# EAGLE design board (EAGLE 8.2.2)

## Sheet 1 of 2
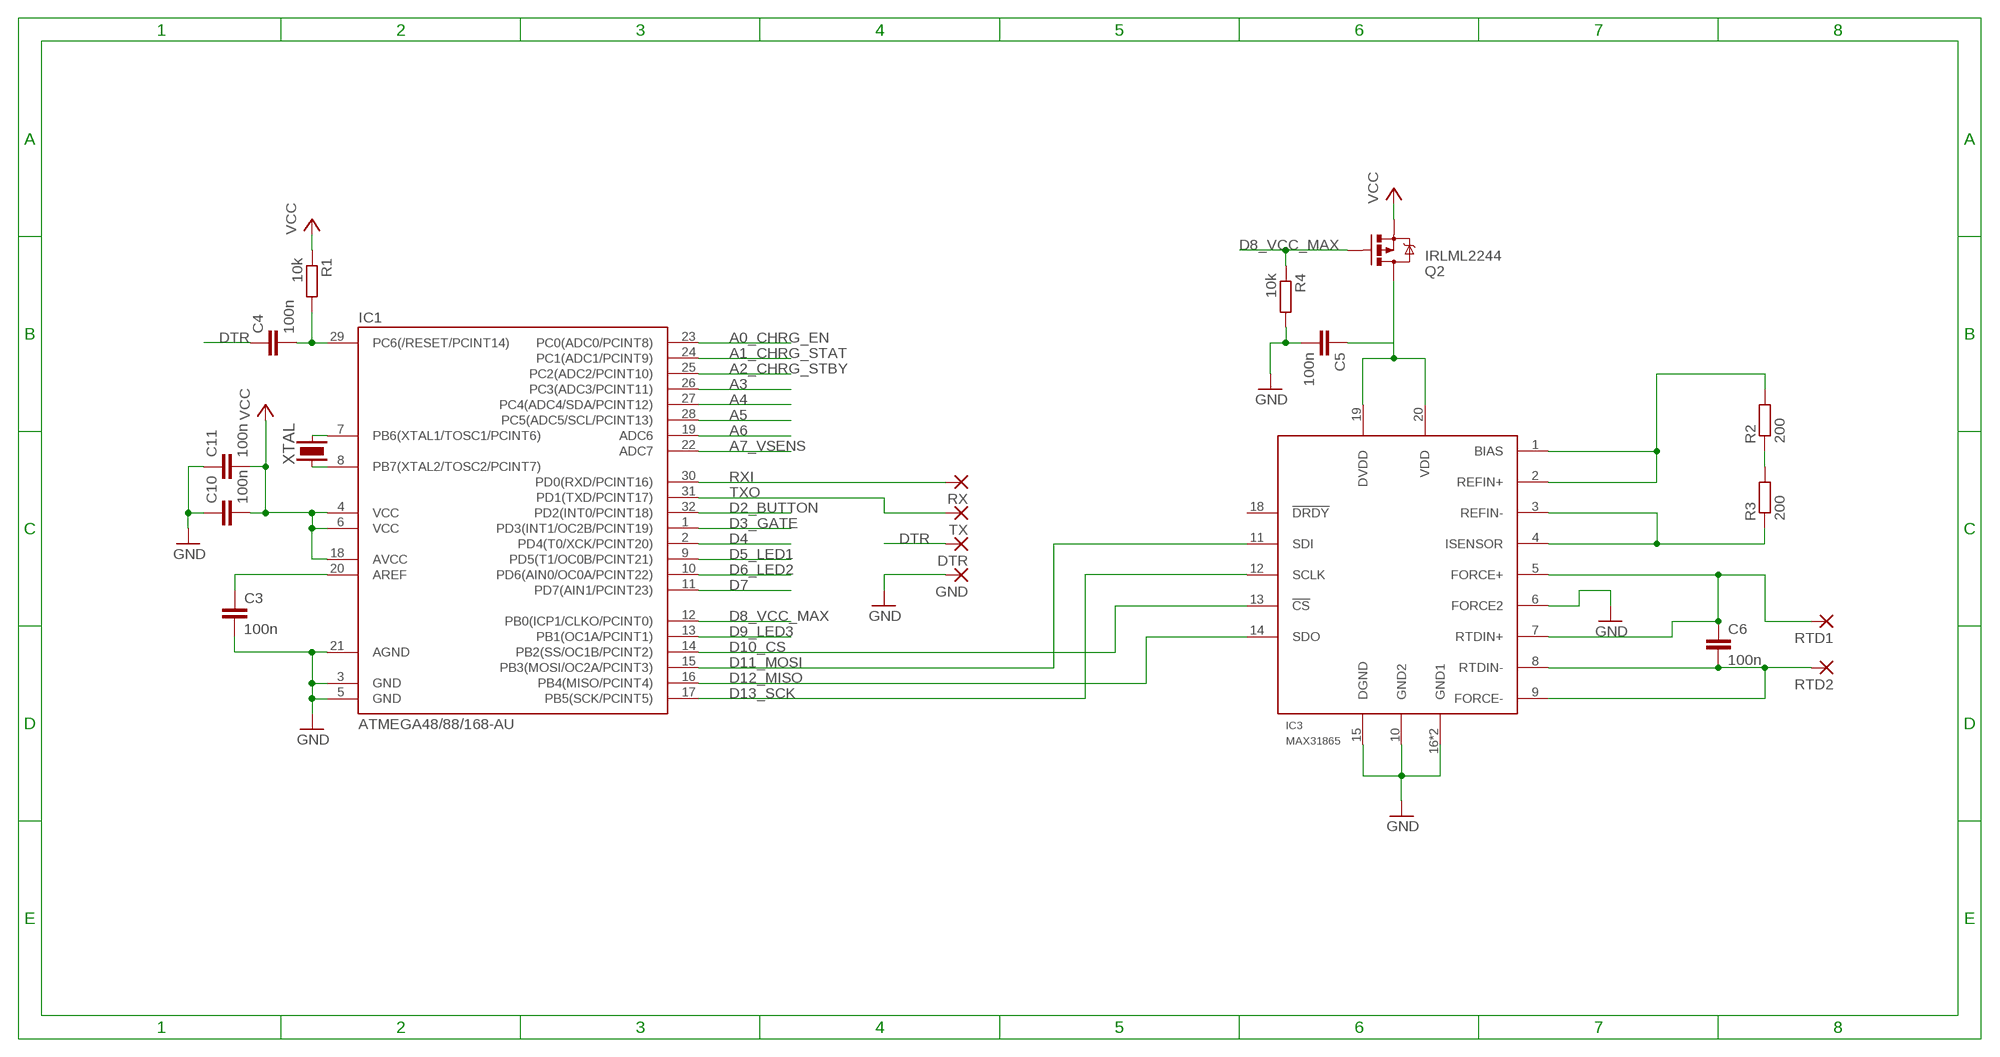
[diagram p0: schematic, sheet 1]

### Parts
C3  100n  C-EUC0603  [C0603]
C4  100n  C-EUC0603  [C0603]
C5  100n  C-EUC0603  [C0603]
C6  100n  C-EUC0603  [C0603]
C10  100n  C-EUC0603  [C0603]
C11  100n  C-EUC0603  [C0603]
DTR  SMD2  [SMD1,27-2,54]
GND  SMD2  [SMD1,27-2,54]
IC1  ATMEGA48/88/168-AU  [TQFP32-08]
IC3  MAX31865  [TQFN20-5X5]
Q2  IRLML2244  MOSFET-PCHANNELIRLML2244  [SOT23-3]
R1  10k  R-EU_R0603  [R0603]
R2  200  R-EU_R0603  [R0603]
R3  200  R-EU_R0603  [R0603]
R4  10k  R-EU_R0603  [R0603]
RTD1  SMD2  [SMD1,27-2,54]
RTD2  SMD2  [SMD1,27-2,54]
RX  SMD2  [SMD1,27-2,54]
TX  SMD2  [SMD1,27-2,54]
XTAL  XTAL-HCS10  [CS10]

### Nets
A0_CHRG_EN: IC1.23(PC0(ADC0/PCINT8)) ; also sheet 2
A1_CHRG_STAT: IC1.24(PC1(ADC1/PCINT9)) ; also sheet 2
A2_CHRG_STBY: IC1.25(PC2(ADC2/PCINT10)) ; also sheet 2
A3: IC1.26(PC3(ADC3/PCINT11))
A4: IC1.27(PC4(ADC4/SDA/PCINT12))
A5: IC1.28(PC5(ADC5/SCL/PCINT13))
A6: IC1.19(ADC6)
A7_VSENS: IC1.22(ADC7) ; also sheet 2
AREF: C3.1 IC1.20(AREF)
D2_BUTTON: IC1.32(PD2(INT0/PCINT18)) ; also sheet 2
D3_GATE: IC1.1(PD3(INT1/OC2B/PCINT19)) ; also sheet 2
D4: IC1.2(PD4(T0/XCK/PCINT20))
D5_LED1: IC1.9(PD5(T1/OC0B/PCINT21)) ; also sheet 2
D6_LED2: IC1.10(PD6(AIN0/OC0A/PCINT22)) ; also sheet 2
D7: IC1.11(PD7(AIN1/PCINT23))
D8_VCC_MAX: IC1.12(PB0(ICP1/CLKO/PCINT0)) Q2.1(G) R4.1
D9_LED3: IC1.13(PB1(OC1A/PCINT1)) ; also sheet 2
D10_CS: IC1.14(PB2(SS/OC1B/PCINT2)) IC3.13(!CS)
D11_MOSI: IC1.15(PB3(MOSI/OC2A/PCINT3)) IC3.11(SDI)
D12_MISO: IC1.16(PB4(MISO/PCINT4)) IC3.14(SDO)
D13_SCK: IC1.17(PB5(SCK/PCINT5)) IC3.12(SCLK)
DTR: C4.1 DTR.1(P)
GND: C3.2 C5.2 C10.1 C11.1 GND.1(P) IC1.3(GND) IC1.5(GND) IC1.21(AGND) IC3.6(FORCE2) IC3.10(GND2) IC3.15(DGND) IC3.16(GND1) IC3.EXP(GND1) R4.2 ; also sheet 2
N$5: R2.1 R3.2
RST: C4.2 IC1.29(PC6(/RESET/PCINT14)) R1.2
RXI: IC1.30(PD0(RXD/PCINT16)) RX.1(P)
TEMP_IN+: C6.1 IC3.5(FORCE+) IC3.7(RTDIN+) RTD1.1(P)
TEMP_IN-: C6.2 IC3.8(RTDIN-) IC3.9(FORCE-) RTD2.1(P)
TEMP_REF+: IC3.1(BIAS) IC3.2(REFIN+) R2.2
TEMP_REF-: IC3.3(REFIN-) IC3.4(ISENSOR) R3.1
TXO: IC1.31(PD1(TXD/PCINT17)) TX.1(P)
VCC: C10.2 C11.2 IC1.4(VCC) IC1.6(VCC) IC1.18(AVCC) Q2.2(S) R1.1 ; also sheet 2
VCC_MAX: C5.1 IC3.19(DVDD) IC3.20(VDD) Q2.3(D)
XTAL1: IC1.7(PB6(XTAL1/TOSC1/PCINT6)) XTAL.R(P2)
XTAL2: IC1.8(PB7(XTAL2/TOSC2/PCINT7)) XTAL.L(P1)
Unconnected: IC3.18(!DRDY)

## Sheet 2 of 2
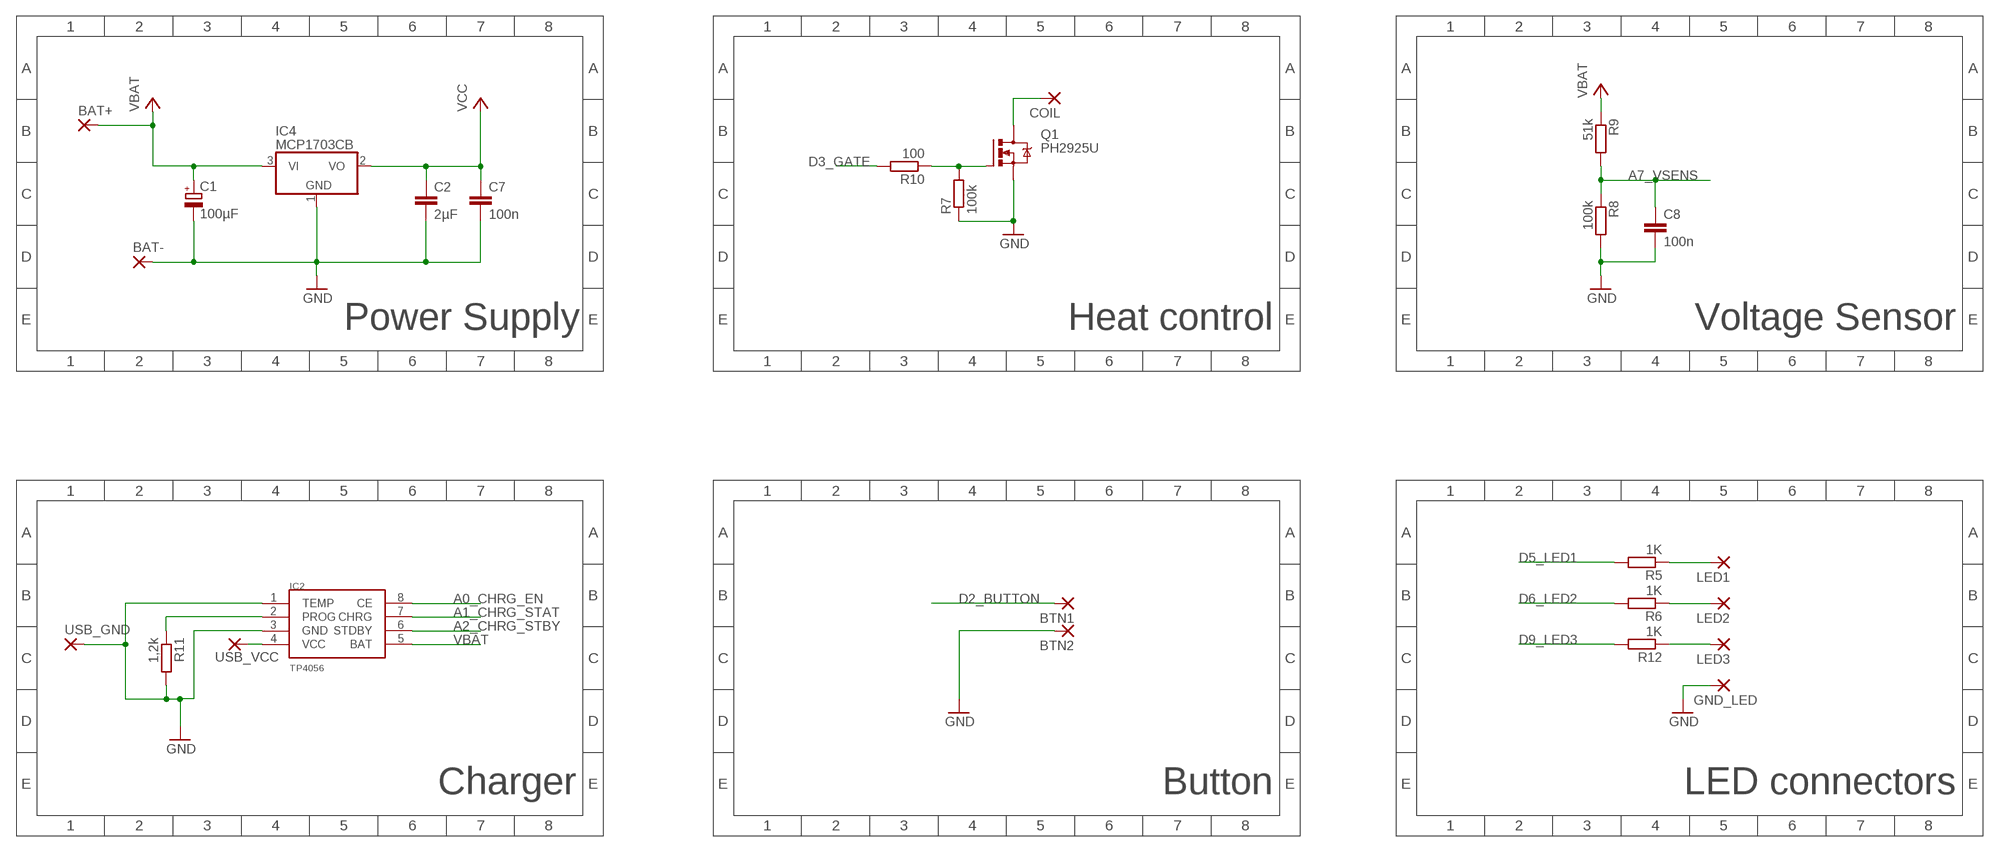
[diagram p1: schematic, sheet 2]

### Parts
BAT+  SMD2  [SMD1,27-2,54]
BAT-  WIREPAD4,16O1,6  [4,16O1,6]
BTN1  SMD2  [SMD1,27-2,54]
BTN2  SMD2  [SMD1,27-2,54]
C1  100µF  CPOL-EUCT7343  [CT7343]
C2  2µF  C-EUC1206  [C1206]
C7  100n  C-EUC0603  [C0603]
C8  100n  C-EUC0603  [C0603]
COIL  WIREPAD4,16O1,6  [4,16O1,6]
GND_LED  SMD2  [SMD1,27-2,54]
IC2  TP4056  [SOP-8]
IC4  MCP1703CB  [SOT23]
LED1  SMD2  [SMD1,27-2,54]
LED2  SMD2  [SMD1,27-2,54]
LED3  SMD2  [SMD1,27-2,54]
Q1  PH2925U  [SOT-669]
R5  1K  R-EU_R0603  [R0603]
R6  1K  R-EU_R0603  [R0603]
R7  100k  R-EU_R0603  [R0603]
R8  100k  R-EU_R0603  [R0603]
R9  51k  R-EU_R0603  [R0603]
R10  100  R-EU_R0603  [R0603]
R11  1,2k  R-EU_R0603  [R0603]
R12  1K  R-EU_R0603  [R0603]
USB_GND  SMD2  [SMD1,27-2,54]
USB_VCC  SMD2  [SMD1,27-2,54]

### Nets
A0_CHRG_EN: IC2.8(CE) ; also sheet 1
A1_CHRG_STAT: IC2.7(CHRG) ; also sheet 1
A2_CHRG_STBY: IC2.6(STDBY) ; also sheet 1
A7_VSENS: C8.1 R8.1 R9.2 ; also sheet 1
COIL: COIL.1(P) Q1.5(D)
D2_BUTTON: BTN1.1(P) ; also sheet 1
D3_GATE: R10.2 ; also sheet 1
D5_LED1: R5.2 ; also sheet 1
D6_LED2: R6.2 ; also sheet 1
D9_LED3: R12.2 ; also sheet 1
GATE: Q1.4(G) R7.2 R10.1
GND: BAT-.1(P) BTN2.1(P) C1.- C2.2 C7.2 C8.2 GND_LED.1(P) IC2.1(TEMP) IC2.3(GND) IC4.1(GND) Q1.1(S) Q1.2(S) Q1.3(S) R7.1 R8.2 R11.2 USB_GND.1(P) ; also sheet 1
LED1: LED1.1(P) R5.1
LED2: LED2.1(P) R6.1
LED3: LED3.1(P) R12.1
PROG: IC2.2(PROG) R11.1
VBAT: BAT+.1(P) C1.+ IC2.5(BAT) IC4.3(VI) R9.1
VCC: C2.1 C7.1 IC4.2(VO) ; also sheet 1
VUSB: IC2.4(VCC) USB_VCC.1(P)

### Notes on the sheet
- Heat control | Voltage Sensor
- Power Supply
- Charger | Button | LED connectors

## Library data of the parts
BAT+ BTN1 BTN2 DTR GND GND_LED LED1-LED3 RTD1 RTD2 RX TX USB_GND USB_VCC = wirepad:SMD2: SMD PAD
BAT- COIL = wirepad:WIREPAD: Wire PAD connect wire on PCB
C1 = resistor:CPOL-EU: POLARIZED CAPACITOR, European symbol
C2-C8 C10 C11 = rcl:C-EU: CAPACITOR, European symbol
IC1 = atmega8:ATMEGA48/88/168
IC2 = TP4056:TP4056
IC3 = Oles komponentbibliotek:MAX31865: RTD to Digital Converter The MAX31865 is a resistance-to-digital converter optimized for platinum resistance temperature detectors (RTDs). An external resistor sets the sensitivity for the RTD being used and a delta-sigma ADC converts the ratio of the RTD resistance to the reference resistance into digital form. The MAX31865’s inputs are protected against overvoltage faults up to +/-50V. Programmable detection of RTD and cable open and short conditions is included.
IC4 = linear:MCP1703: 250 mA, 16V, Low Quiescent Current LDO Regulator Source: http://ww1.microchip.com/downloads/en/DeviceDoc/22049b.pdf
Q1 = selfmade:PH2925U
Q2 = SparkFun-DiscreteSemi:MOSFET-PCHANNEL: Generic PMOSFET IRLML2244 - TRANS-11153 (SOT-23 -20V -4.3A) (1.Gate 2.Source 3.Drain) FQP27P06 - COM-10349 <http://www.sparkfun.com/products/10349> (TO-220 -60V -27A) (1.Gate 2.Source 3.Drain); PROD_ID: TRANS-11153
R1-R12 = rcl:R-EU_: RESISTOR, European symbol
XTAL = xtal:XTAL-H: Quartz crystal

## Board
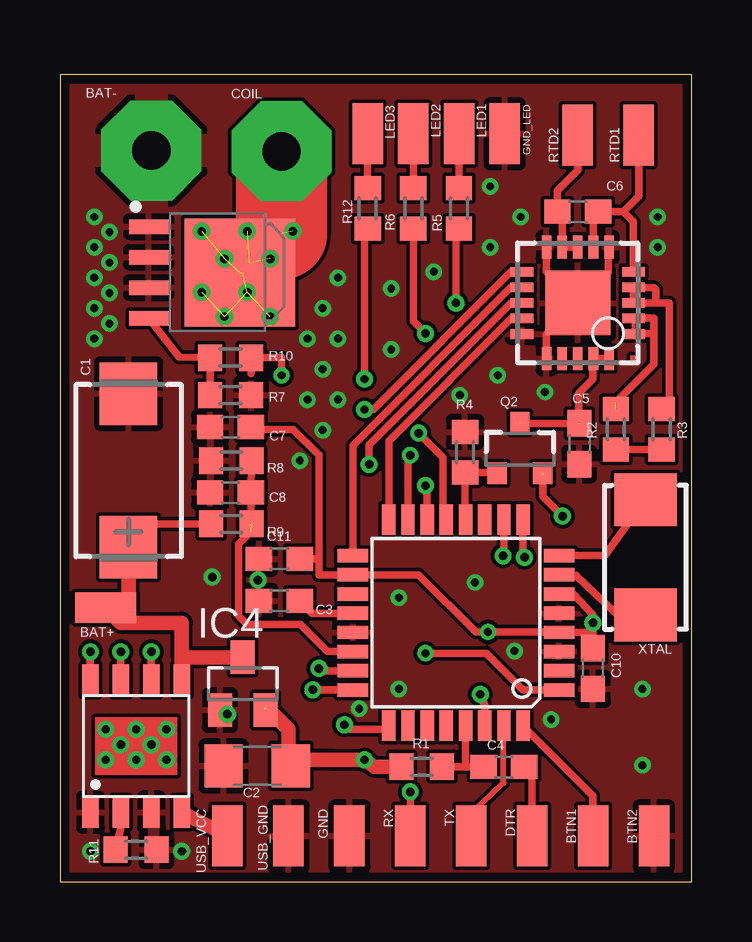
[diagram p2: board, top side]
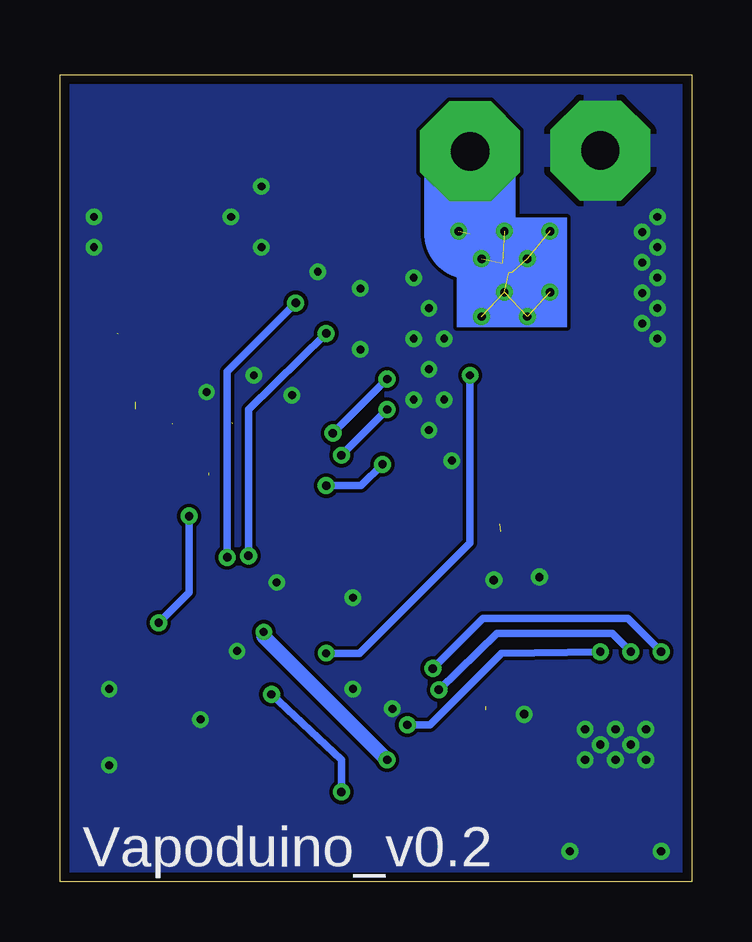
[diagram p3: board, bottom side, seen from below]

Size 26.34 x 33.65 mm. Coordinates in mm from the lower left corner, seen from the top.
Outline: 0,0 26.34,0 26.34,33.65 0,33.65 0,0
Copper layers (1*16): Top 0.0356mm / dielectric 1.5011mm / Bottom 0.0356mm
Design rules "LaenPCBOrder *": minimum track width 10mil, minimum drill 13mil, track to track 6mil, track to pad 6mil, pad to pad 6mil, via to via 6mil, smd to smd 6mil, copper to edge 15mil, drill to drill 6mil, minimum pad ring 7mil, minimum via ring 7mil, stop-mask expansion 3mil, vias tented up to drill 20mil, thermal gap 10mil

### Footprints (pad centres in the part's own frame; a part is rotated, then mirrored left to right if it is on the bottom)
SMD1,27-2,54 = smd 1.27 x 2.54: 1 0,0
4,16O1,6 = drill 1.6 pad 4.166 octagon: 1 0,0
CT7343 = smd 2.6 x 2.4: + 3.2,0; - -3.2,0
C1206 = smd 1.6 x 1.8: 1 -1.4,0; 2 1.4,0
C0603 = smd 1.1 x 1: 1 -0.85,0; 2 0.85,0
TQFP32-08 = smd 1.27 x 0.559: 1 -4.293,2.8; 2 -4.293,2; 3 -4.293,1.2; 4 -4.293,0.4; 5 -4.293,-0.4; 6 -4.293,-1.2; 7 -4.293,-2; 8 -4.293,-2.8; 17 4.293,-2.8; 18 4.293,-2; 19 4.293,-1.2; 20 4.293,-0.4; 21 4.293,0.4; 22 4.293,1.2; 23 4.293,2; 24 4.293,2.8 | smd 0.559 x 1.27: 9 -2.8,-4.293; 10 -2,-4.293; 11 -1.2,-4.293; 12 -0.4,-4.293; 13 0.4,-4.293; 14 1.2,-4.293; 15 2,-4.293; 16 2.8,-4.293; 25 2.8,4.293; 26 2,4.293; 27 1.2,4.293; 28 0.4,4.293; 29 -0.4,4.293; 30 -1.2,4.293; 31 -2,4.293; 32 -2.8,4.293
SOP-8 = smd 1.3 x 0.7: 1 -2.75,1.905; 2 -2.75,0.635; 3 -2.75,-0.635; 4 -2.75,-1.905; 5 2.75,-1.905; 6 2.75,-0.635; 7 2.75,0.635; 8 2.75,1.905
TQFN20-5X5 = smd 0.95 x 0.4: 1 -2.325,1.3; 2 -2.325,0.65; 3 -2.325,0; 4 -2.325,-0.65; 5 -2.325,-1.3; 11 2.325,-1.3; 12 2.325,-0.65; 13 2.325,0; 14 2.325,0.65; 15 2.325,1.3 | smd 0.4 x 0.95: 6 -1.3,-2.325; 7 -0.65,-2.325; 8 0,-2.325; 9 0.65,-2.325; 10 1.3,-2.325; 16 1.3,2.325; 17 0.65,2.325; 18 0,2.325; 19 -0.65,2.325; 20 -1.3,2.325 | smd 2.7 x 2.7: EXP 0,0
SOT23 = smd 1 x 1.4: 1 -0.95,-1.1; 2 0.95,-1.1; 3 0,1.1
SOT-669 = smd 1.65 x 0.6: 1 -3.92,1.905; 2 -3.92,0.635; 3 -3.92,-0.635; 4 -3.92,-1.905 | smd 4.6 x 4.5: 5 -0.12,0
SOT23-3 = smd 0.8 x 0.9: 1 -0.95,-1; 2 0.95,-1; 3 0,1.1
R0603 = smd 1 x 1.1: 1 -0.85,0; 2 0.85,0
CS10 = smd 2.2 x 2.6: L -2.4,0; R 2.4,0

### Placement (x,y rotation side)
BAT+  1.91,11.43 270 top
BAT-  3.81,30.48 0 top
BTN1  22.23,1.91 180 top
BTN2  24.77,1.91 180 top
C1  2.86,17.14 270 top
C2  8.22,4.83 180 top
C3  9.14,11.72 180 top
C4  18.51,4.79 180 top
C5  21.65,18.26 270 top
C6  21.59,27.94 180 top
C7  7.11,18.95 180 top
C8  7.11,16.22 180 top
C10  22.23,8.89 90 top
C11  9.14,13.46 0 top
COIL  9.24,30.45 0 top
DTR  19.68,1.91 0 top
GND  12.06,1.91 0 top
GND_LED  18.54,31.18 180 top
IC1  16.51,10.79 180 top
IC2  3.17,5.65 90 top
IC3  21.59,24.13 180 top
IC4  7.62,8.26 0 top
LED1  16.64,31.18 180 top
LED2  14.73,31.18 180 top
LED3  12.83,31.18 0 top
Q1  7.62,25.4 0 top
Q2  19.18,18.03 0 top
R1  15.08,4.79 0 top
R2  23.18,18.86 90 top
R3  25.08,18.86 270 top
R4  16.89,17.91 90 top
R5  16.64,28.07 270 top
R6  14.73,28.07 270 top
R7  7.11,20.29 180 top
R8  7.14,17.56 180 top
R9  7.14,14.92 0 top
R10  7.11,21.84 0 top
R11  3.17,1.33 0 top
R12  12.83,28.07 270 top
RTD1  24.13,31.11 0 top
RTD2  21.59,31.11 0 top
RX  14.61,1.91 0 top
TX  17.14,1.91 0 top
USB_GND  9.53,1.91 180 top
USB_VCC  6.99,1.91 180 top
XTAL  24.42,13.53 270 top

### Tracks (layer width: path | path; a pad name or v marks a point on that pad's centre or on a via)
A0_CHRG_EN  (via drill 0.35)
  Top 0.305: IC1.23 10.89,8.79 v10.79,8.89 | IC2.8 v1.27,9.59
  Bottom 0.305: v10.79,8.89 8.7,10.99 2.67,10.99 v1.27,9.59
A1_CHRG_STAT  (via drill 0.35)
  Top 0.305: IC2.7 v2.54,9.59 | IC1.24 v10.54,8
  Bottom 0.305: v2.54,9.59 3.3,10.35 8.13,10.35 v10.54,8
A2_CHRG_STBY  (via drill 0.35)
  Top 0.305: IC2.6 v3.81,9.59 | IC1.25 13.56,6.35 12.06,6.35 11.87,6.54 v11.86,6.54
  Bottom 0.305: v11.86,6.54 10.92,6.54 7.94,9.53 v3.81,9.59
A7_VSENS  (1 unrouted)
  Top 0.305: R8.1 C8.1 7.96,14.61 7.44,14.09 7.44,11.09 7.81,10.72 10.03,10.72 11.16,9.6 IC1.22
AREF
  Top 0.305: C3.1 10.52,11.2 IC1.20
COIL  (via drill 0.35)  (10 unrouted)
  Top 2.54: 9.24,27.01 7.89,25.79
  Top 3.81: COIL.1 9.24,27.01
  Bottom 2.54: 9.24,27.02 7.62,25.4
  Bottom 3.81: COIL.1 9.24,27.02
  other vias: 5.91,27.11 7.81,27.11 9.72,27.11 6.86,25.97 8.76,25.97 7.81,24.57 5.91,24.57 6.86,23.56 8.76,23.56
D2_BUTTON
  Top 0.305: BTN1.1 22.23,3.59 IC1.32
D3_GATE  (via drill 0.33)
  Top 0.305: IC1.1 19.3,8 17.78,9.53 v15.24,9.53 | 7.96,21.18 R10.2 9.24,21.84 v9.24,21.11
  Bottom 0.305: v15.24,9.53 13.84,9.53 9.24,14.13 v9.24,21.11
D5_LED1  (via drill 0.35)
  Top 0.305: IC1.9 19.31,13.58 v19.37,13.53 | v16.51,24.13 16.51,27.22 R5.2
  Bottom 0.305: v19.37,13.53 19.37,21.27 v16.51,24.13
D6_LED2  (via drill 0.35)
  Top 0.305: IC1.10 18.51,13.56 v18.48,13.59 | v15.24,22.86 14.73,23.37 R6.2
  Bottom 0.305: v18.48,13.59 18.48,19.68 v15.24,22.86
D8_VCC_MAX
  Top 0.305: IC1.12 16.89,15.09 R4.1 18.2,17.06 Q2.1
D9_LED3  (via drill 0.35)
  Top 0.305: IC1.13 15.98,15.6 15.97,15.61 15.97,17.68 v14.96,18.7 | v12.7,20.95 12.7,27.09 R12.2
  Bottom 0.305: v14.96,18.7 v12.7,20.95
D10_CS  (via drill 0.35)
  Top 0.305: IC1.14 15.31,16.44 v15.24,16.51 | v12.89,17.4 12.89,18.21 18.81,24.13 IC3.13
  Bottom 0.305: v15.24,16.51 13.78,16.51 v12.89,17.4
D11_MOSI  (via drill 0.35)
  Top 0.305: IC1.15 14.51,17.68 v14.61,17.78 | v12.7,19.68 13.06,19.68 18.81,25.43 IC3.11
  Bottom 0.305: v14.61,17.78 v12.7,19.68
D12_MISO
  Top 0.305: IC1.16 13.71,18.38 18.81,23.48 IC3.14
D13_SCK
  Top 0.305: IC1.17 12.22,18.19 18.81,24.78 IC3.12
DTR
  Top 0.305: DTR.1 19.68,4.73 C4.1
GATE
  Top 0.305: Q1.4 4.97,21.87 R10.1 R7.2
GND  (via drill 0.33, 0.35)
  Top 0.305: IC3.16 20.29,22.83 IC3.EXP | IC3.10 20.29,25.43 20.95,24.77 22.23,24.77 22.86,25.4 22.86,26.43 IC3.6
  other vias: 14.13,11.84 18.95,9.62 10,17.56 8.26,12.57 6.99,6.99 17.3,12.48 11.59,22.64 10.95,23.91 11.59,25.18 10.95,21.37 11.59,20.1 10.95,18.83 10.32,20.1 10.32,22.64 17.94,28.99 17.94,26.45 19.21,27.72 24.92,27.72 24.92,26.45 20.48,6.76 24.29,4.86 24.29,8.03 6.35,12.7 5.08,1.27 1.27,1.27 4.45,6.35 1.91,6.35 4.45,5.08 1.91,5.08 2.54,5.71 3.17,6.35 3.17,5.08 3.81,5.71 1.43,27.72 1.43,26.45 1.43,25.18 1.43,23.91 1.43,22.64 2.06,27.08 2.06,25.81 2.06,24.54 2.06,23.27 14.13,8.03 12.48,7.21 13.81,22.19 13.81,24.73 15.59,25.43 18.26,21.11 16.67,20.29 20.22,20.42
  pour Top: 0,0 26.32,0 26.32,33.62 0,33.62
  pour Bottom: 0,0 26.32,0 26.32,33.62 0,33.62
  pour Top (no thermals): 3.17,33.02 4.45,33.02 4.45,31.11 6.35,31.11 6.35,29.84 4.45,29.84 4.45,27.94 3.17,27.94 3.17,29.84 1.27,29.84 1.27,31.11 3.17,31.11
  pour Bottom (no thermals): 3.17,33.02 4.45,33.02 4.45,31.11 6.35,31.11 6.35,29.84 4.45,29.84 4.45,27.94 3.17,27.94 3.17,29.84 1.27,29.84 1.27,31.11 3.17,31.11
LED1
  Top 0.305: LED1.1 R5.1
LED2
  Top 0.305: LED2.1 R6.1
LED3
  Top 0.305: LED3.1 R12.1
N$5
  Top 0.305: R3.2 R2.1
PROG
  Top 0.305: R11.1 2.54,2.22 IC2.2
RST
  Top 0.305: 16.91,4.79 IC1.29 | 16.91,4.79 R1.2 | C4.2 16.91,4.79
RXI  (via drill 0.35)
  Top 0.305: RX.1 v14.61,3.74 | v17.53,7.81 17.72,7.33 IC1.30
  Bottom 0.305: v14.61,3.74 14.61,5.08 v17.53,7.81
TEMP_IN+
  Top 0.305: IC3.7 22.24,27.64 C6.1 23.5,27.94 | IC3.5 23.91,27.52 23.5,27.94 | RTD1.1 24.13,28.57 23.5,27.94
TEMP_IN-
  Top 0.305: 21.91,30.8 RTD2.1 21.59,29.65 20.74,28.8 C6.2 20.94,27.64 IC3.9 IC3.8
TEMP_REF+  (2 unrouted)
  Top 0.152: IC3.1 IC3.2
  Top 0.305: 24.64,22.86 23.95,22.86 | 23.18,20 24.77,21.59 24.77,23.5 23.93,23.5 IC3.2
TEMP_REF-
  Top 0.305: R3.1 25.4,20.03 25.4,24.13 24.84,24.13 | 24.84,24.13 IC3.3 IC3.4 23.93,24.77 24.77,24.77 24.84,24.69 24.84,24.13
TXO
  Top 0.254: TX.1 17.14,2.83 18.49,4.12 18.49,6.42 IC1.31
VBAT
  Top 0.305: C1.+ 3.83,14.92 R9.1
  Top 0.61: C1.+ 2.86,11.75 BAT+.1 2.54,10.79 5.08,10.79 5.08,9.37 | 5.08,9.37 IC2.5 | IC4.3 5.1,9.36 5.08,9.37
VCC  (via drill 0.33, 0.35)  (2 unrouted)
  Top 0.305: 10.79,13.47 10.79,17.78 9.72,18.86 8.06,18.86 C7.1 | 11.44,5.04 11.48,5.08 | IC1.6 20.89,11.97 21.44,11.97 22.23,11.12 v22.23,10.79 C10.2 22.23,10.16 21.99,10.39 IC1.4 20.78,10.41 v17.84,10.41 17.34,10.41 14.95,12.79 IC1.18 10.79,12.79 10.79,13.47 | 20.13,16.95 20.13,16.07 v20.95,15.24 | C11.2 10.79,13.47
  Top 0.61: 8.57,7.3 9.53,6.35 9.53,4.92 C2.1 10,5.08 11.48,5.08 v12.7,5.08 13.11,4.79 R1.1
  Bottom 0.305: v22.23,10.79 20.95,12.06 v20.95,15.24
  Bottom 0.61: v12.7,5.08 17.84,10.22 v17.84,10.41
VCC_MAX  (2 unrouted)
  Top 0.305: IC3.20 IC3.19 22.23,21.79 22.23,20.95 21.64,20.37 21.64,19.1 | C5.1 19.17,19.11
VUSB
  Top 0.61: USB_VCC.1 IC2.4
XTAL1
  Top 0.305: IC1.7 21.53,12.77 21.5,12.77 23.91,10.49 XTAL.R
XTAL2
  Top 0.305: IC1.8 22.72,13.6 XTAL.L
(copper drawn outside any net)
  shapes: Bottom area x1

### Text on the board
bPlace: Vapoduino_v0.2